# EasyEDA schematic SCH_lab06_2021-12-24.json

## Sheets
1 circuit_1: TITLE: Sheet_1; REV: 1.0; Date: 2021-12-24; Sheet: 1/1; Drawn By: huseyin34; Company: Your Company
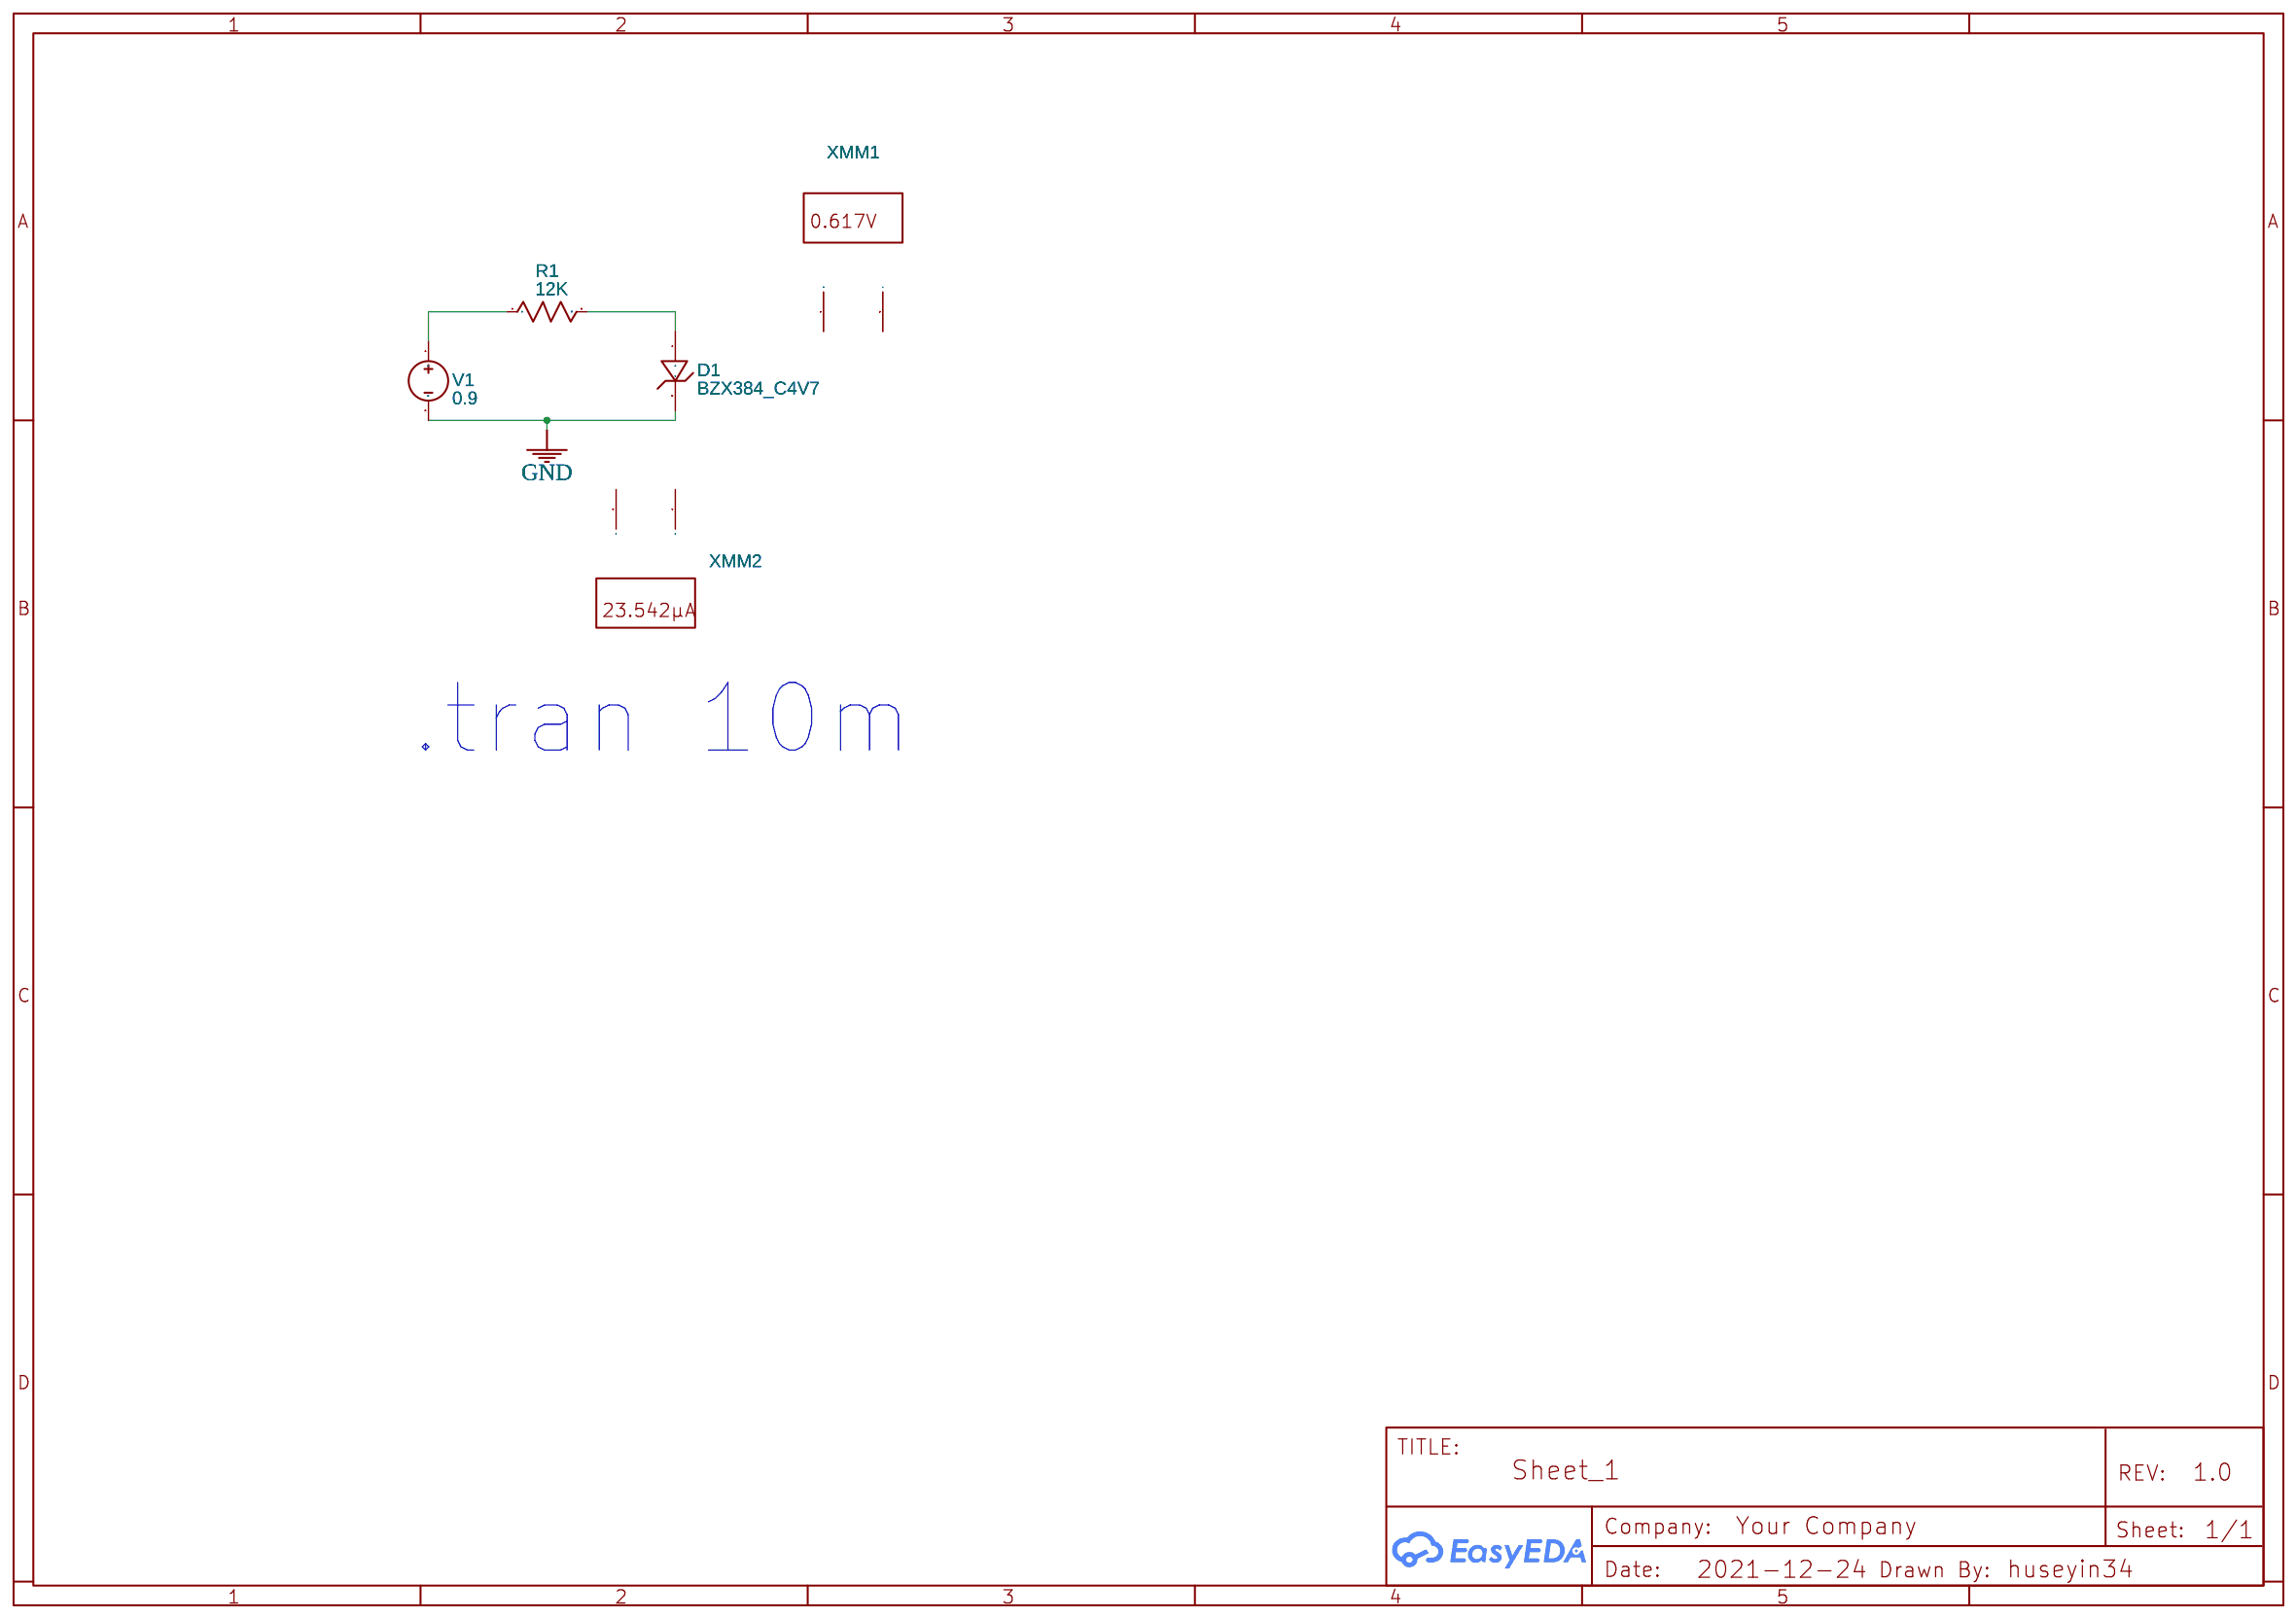
[diagram p0: circuit_1]
2 circuit_2.1
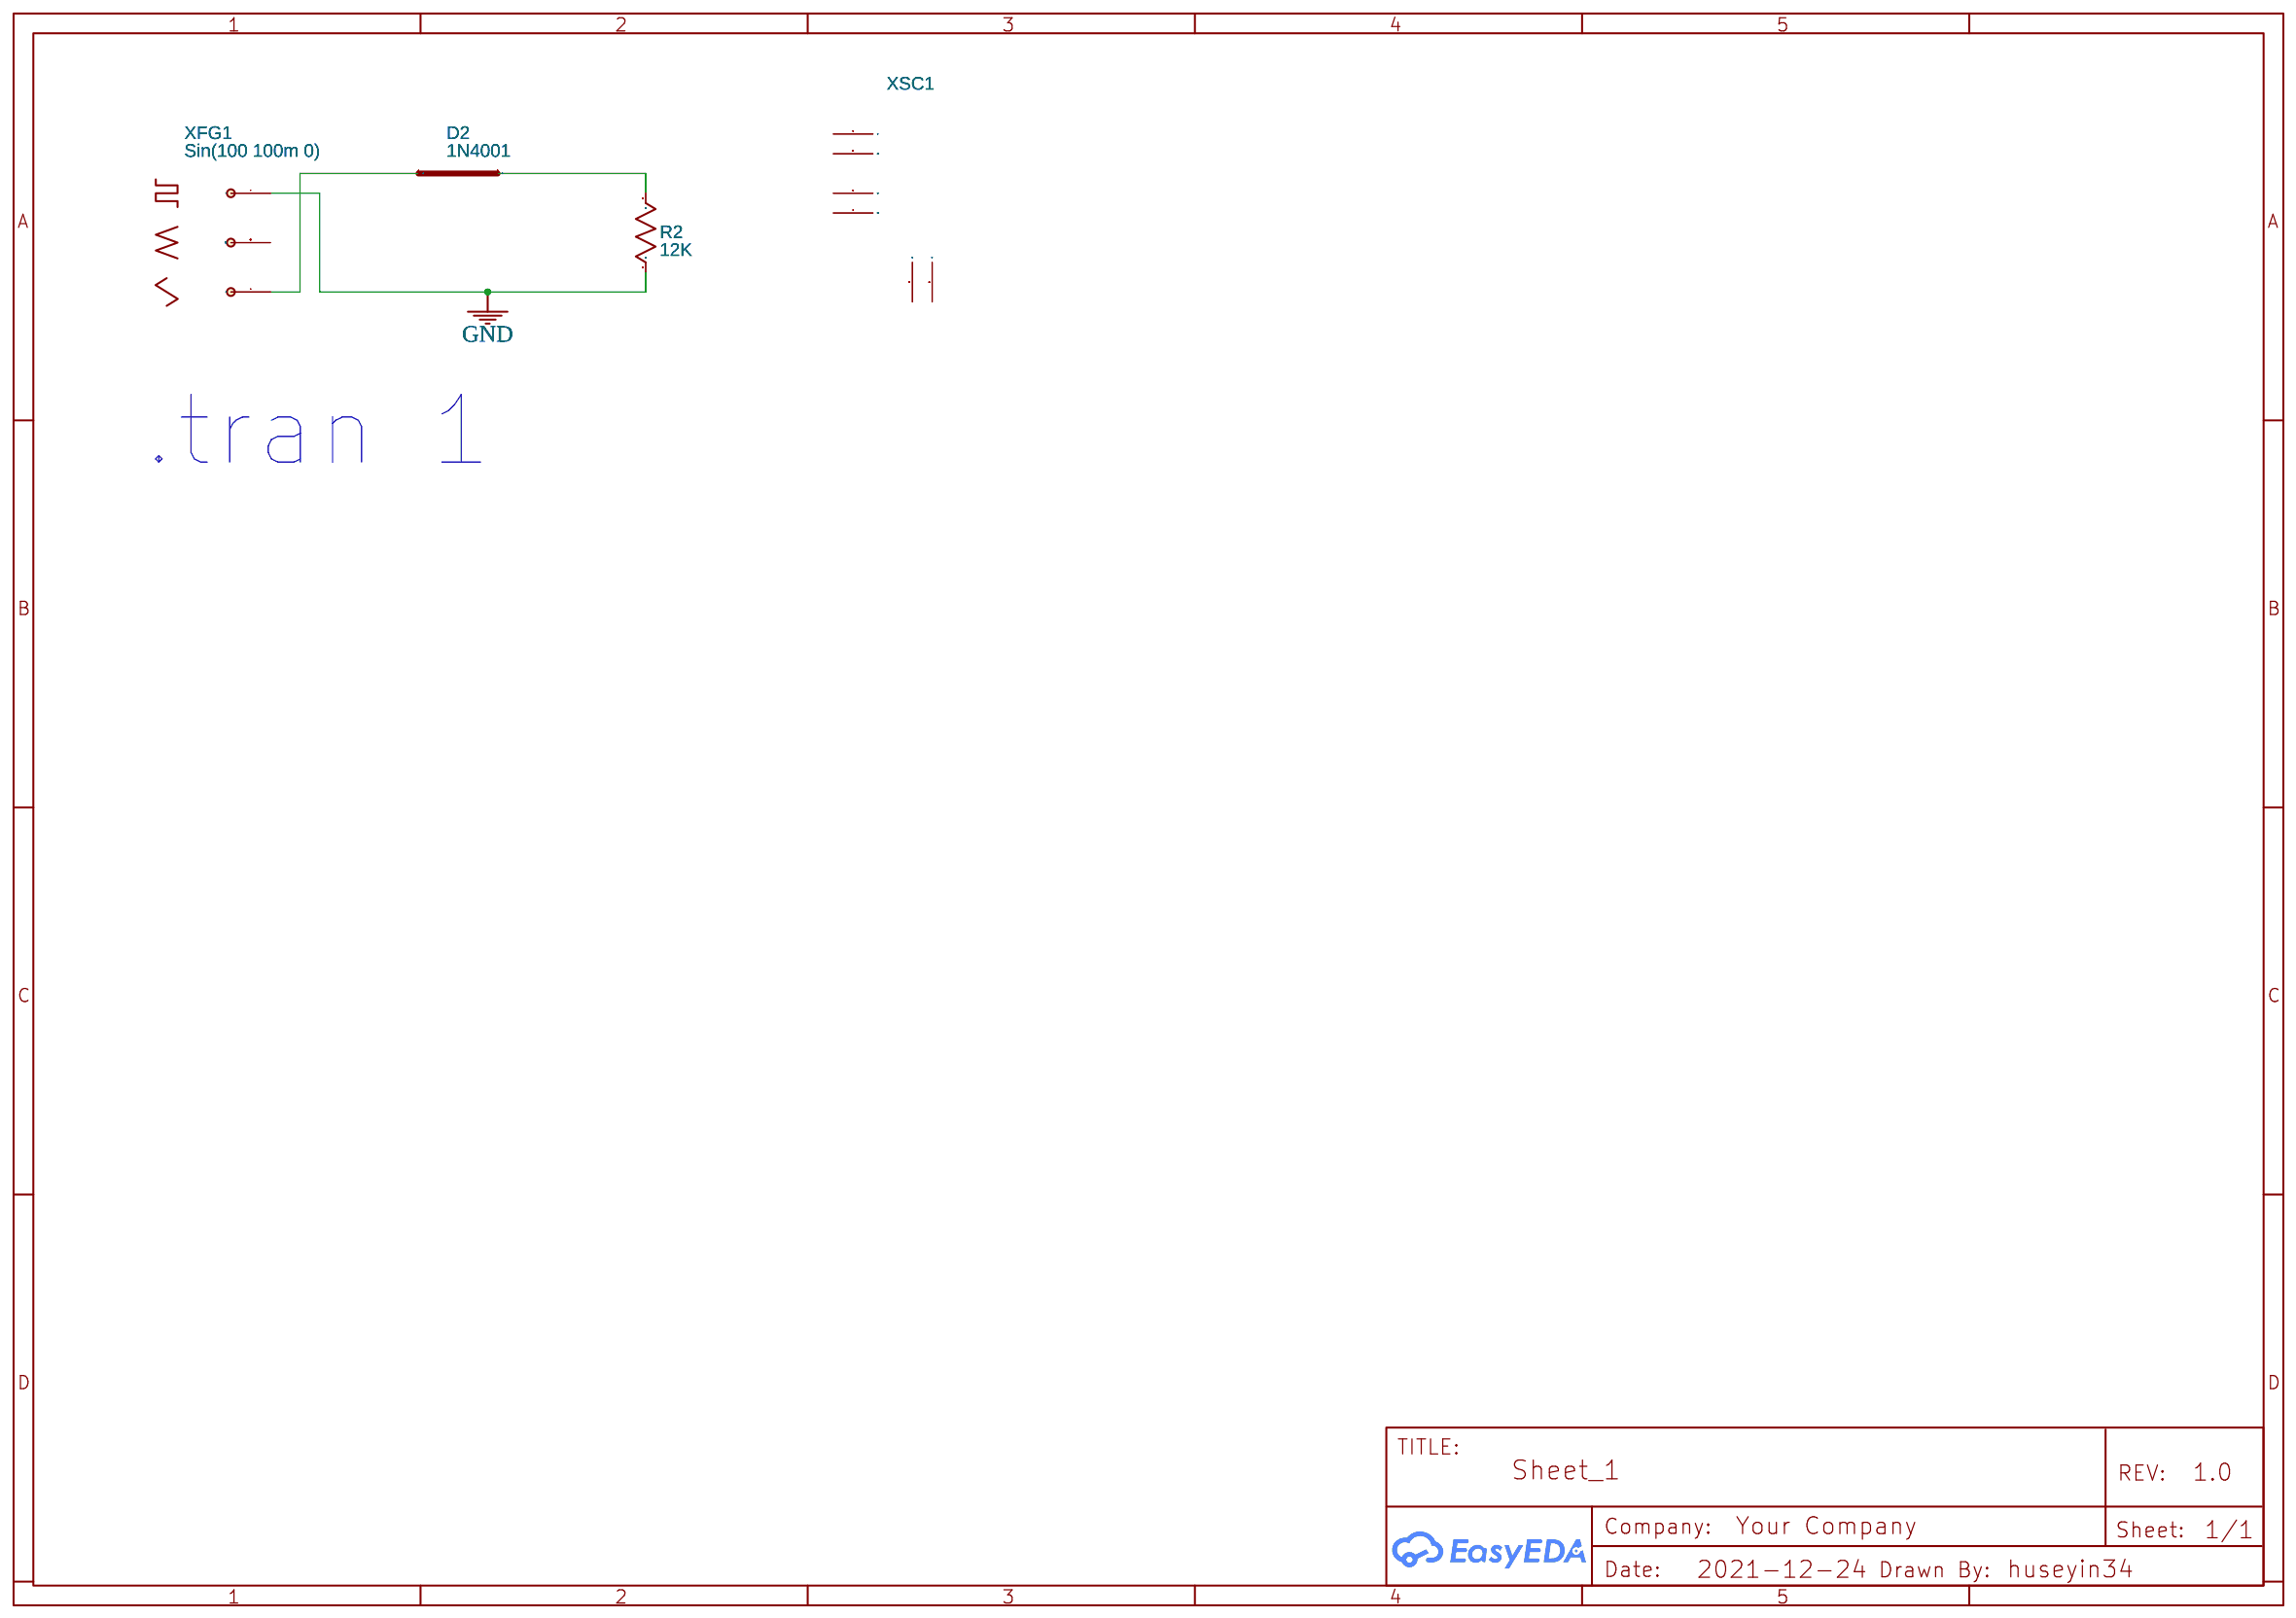
[diagram p1: circuit_2.1]
3 circuit_2.2
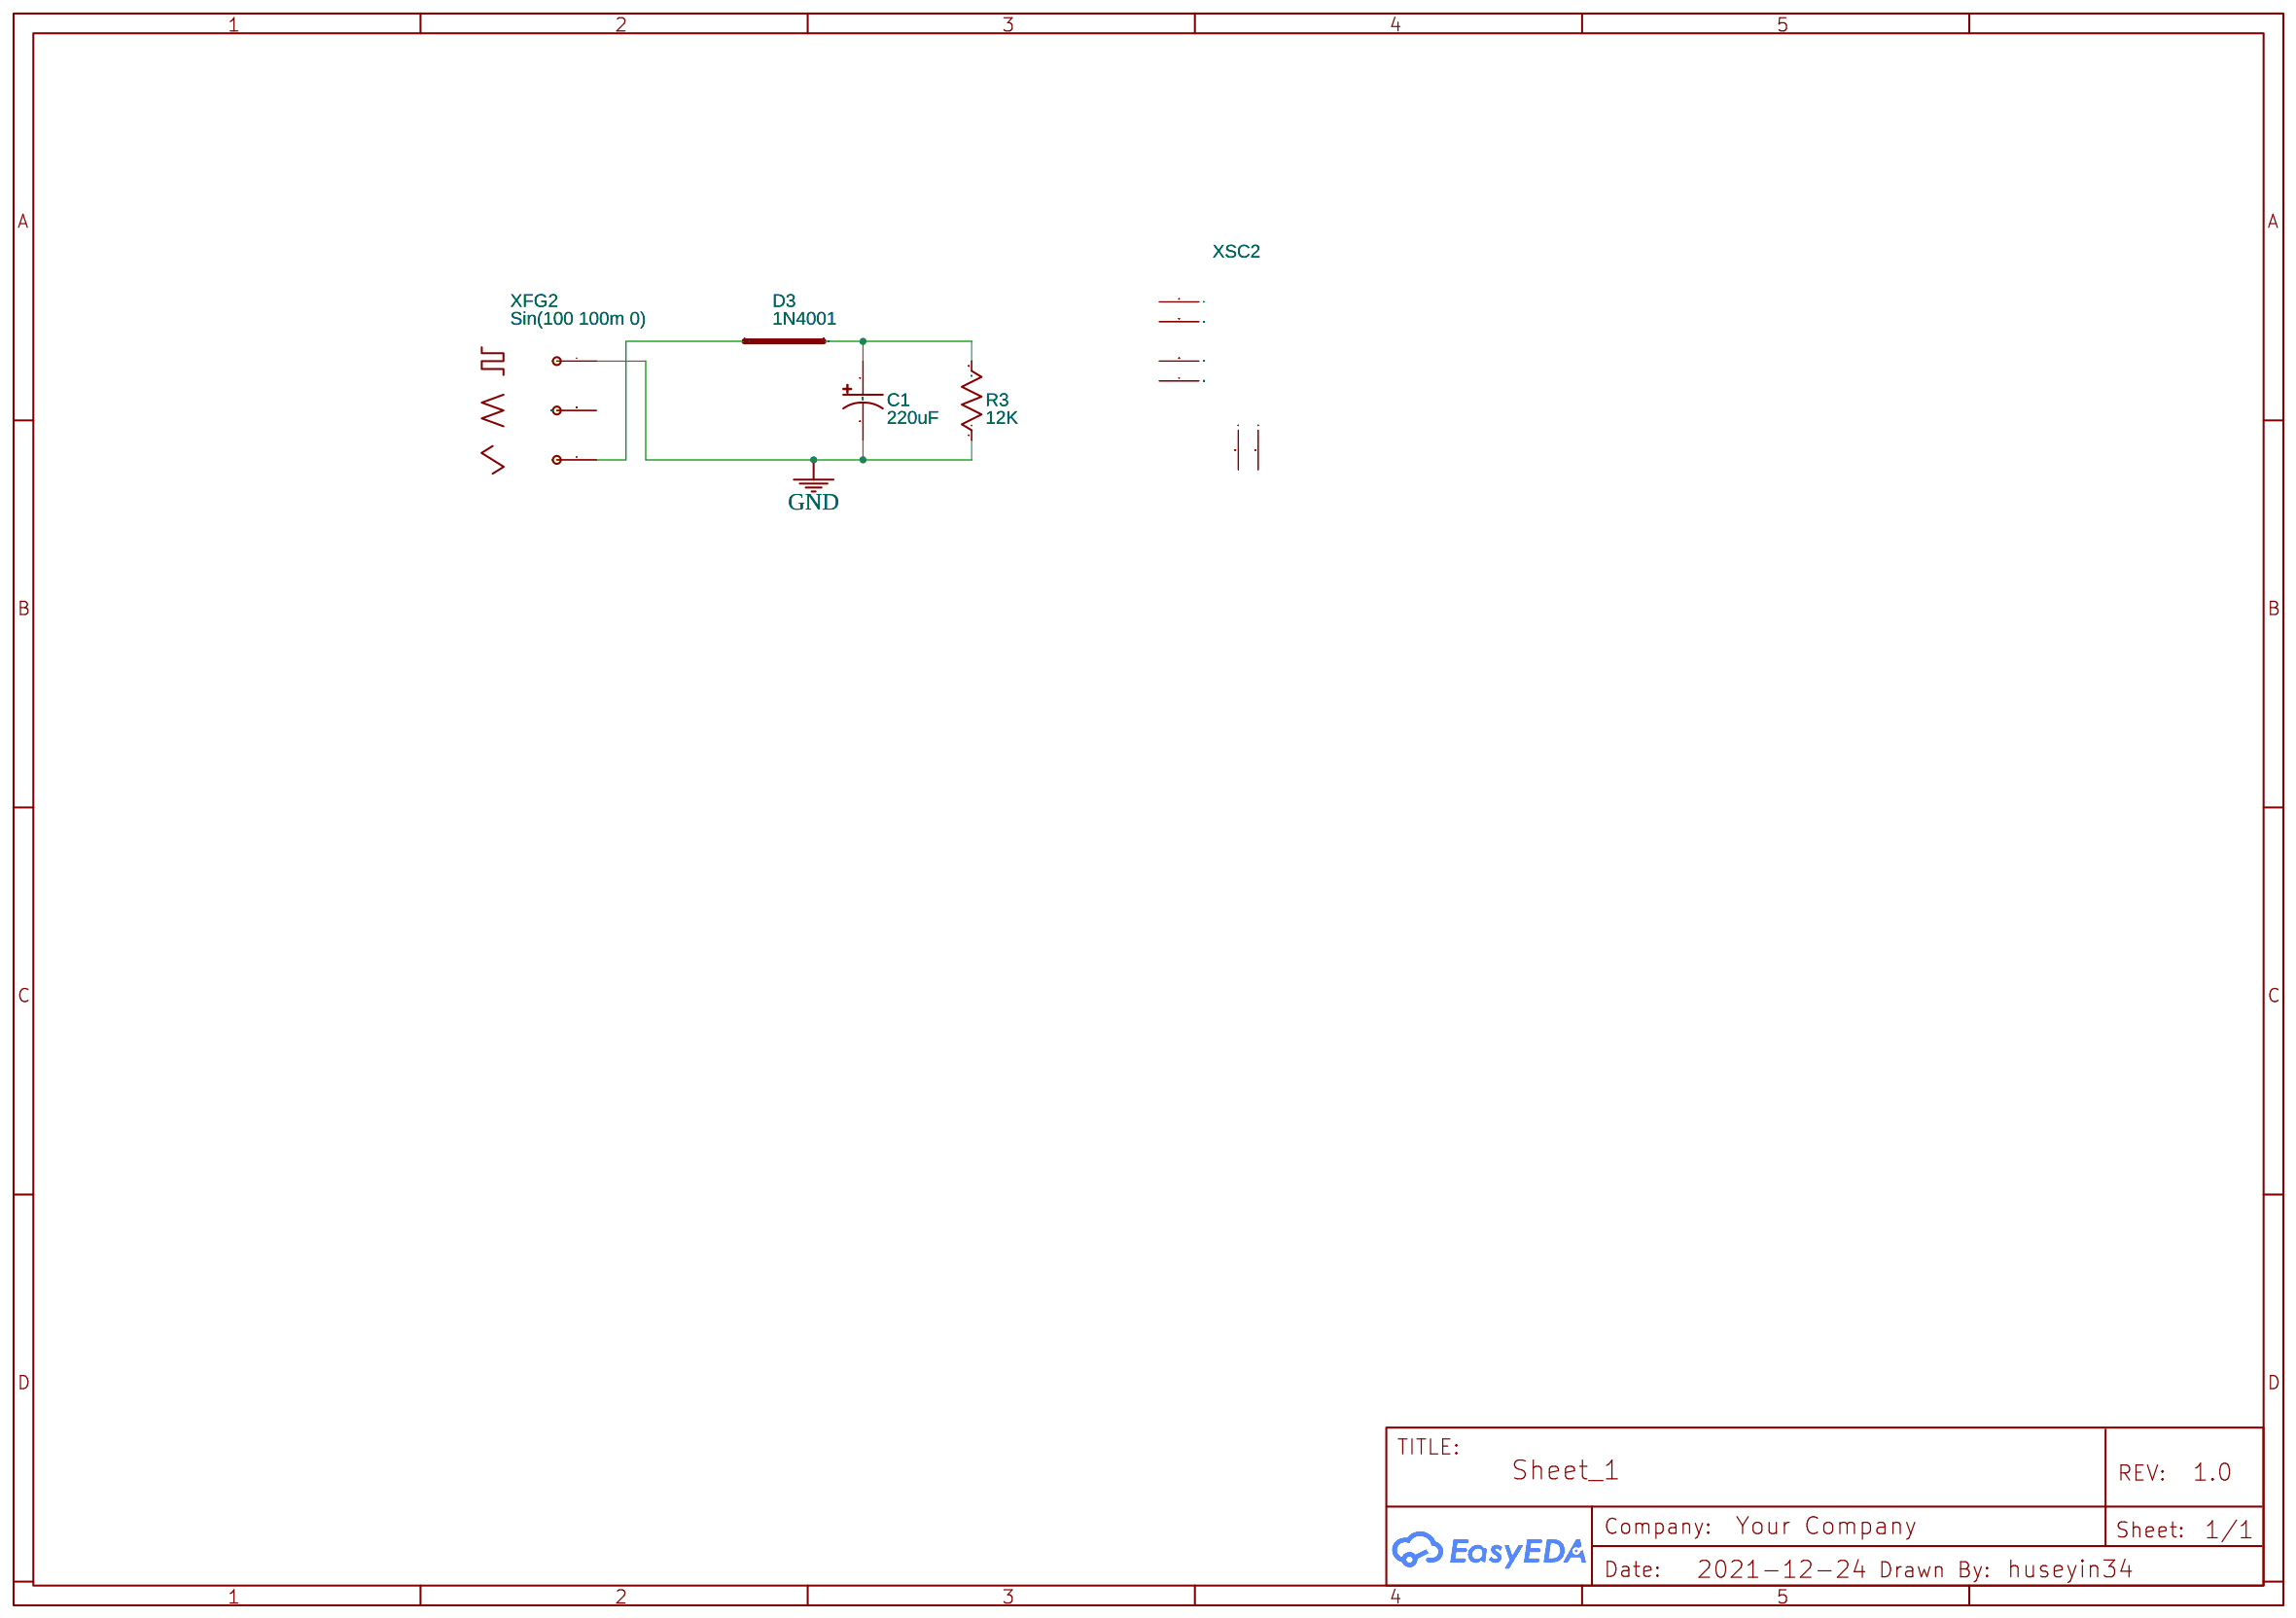
[diagram p2: circuit_2.2]

## Parts
sheet circuit_1
D1  BZX384_C4V7  [SMB]
R1  12K  [AXIAL-0.3]
V1  0.9  [HDR1X2]
XMM1  Multimeter
XMM2  Multimeter
sheet circuit_2.1
D2  1N4001
R2  12K  [AXIAL-0.3]
XFG1  Sin(100 100m 0)
XSC1  Oscilloscope
sheet circuit_2.2
C1  220uF  [CAP-D3.0XF1.5]
D3  1N4001
R3  12K  [AXIAL-0.3]
XFG2  Sin(100 100m 0)
XSC2  Oscilloscope

## Library data of the parts
D1 = BZX84C10L: Contributor: EasyEDA
R1-R3 = Resistor_US: Resistance: 1k; Contributor: EasyEDA; Supplier: YUJING
V1 = VDC: Contributor: EasyEDA; sim: true
XMM1 = MULTIMETER: Supplier: LCSC; Multimeter Type: Voltmeter; Power Type: AC; Voltmeter resistance: 10μ; Ammeter resistance: 1G; NameDisplay: 0; Contributor: EasyEDA; sim: true
XMM2 = MULTIMETER: Supplier: LCSC; Multimeter Type: Amper; Power Type: AC; Voltmeter resistance: 10μ; Ammeter resistance: 1G; NameDisplay: 0; Contributor: EasyEDA; sim: true
D2 D3 = 1N4001: catid: 20; Contributor: EasyEDA; sim: true
XFG1 XFG2 = FUNCTIONGENERATOR: Supplier: LCSC; Waveforms: Sine Wave; Frequency: 100; Duty cycle: 50; Amplitude: 100m; Offset: 0; Rise/Fall Time: 10; NameDisplay: 1; Contributor: EasyEDA; sim: true
XSC1 XSC2 = OSCILLOSCOPE: Contributor: EasyEDA; NameDisplay: 0; sim: true
C1 = Capacitor_Electrolytic_US: Supplier: YUJING; Contributor: EasyEDA; Capacitance: 1u

## Nets
GND: C1.2 D1.2(K) R2.1 R3.1 V1.2 XFG1.- XFG2.-
Net-(C1-1): C1.1 D3.2 R3.2
Net-(D1-1): D1.1(A) R1.2
Net-(D2-1): D2.1 XFG1.+
Net-(D2-2): D2.2 R2.2
Net-(D3-1): D3.1 XFG2.+
Net-(R1-1): R1.1 V1.1

Not connected (* = marked no-connect by the designer): XFG1 COM; XFG2 COM; XMM1 1(+) 2(I); XMM2 1(+) 2(I); XSC1 1(A) 2(GND1) 3(B) 4(GND2) 5(T+) 6(T-); XSC2 1(A) 2(GND1) 3(B) 4(GND2) 5(T+) 6(T-)

## Notes on the sheets
sheet 1
- .tran 10m
sheet 2
- .tran 1
